# EAGLE design GamePup_Cape (EAGLE 7.7.0)
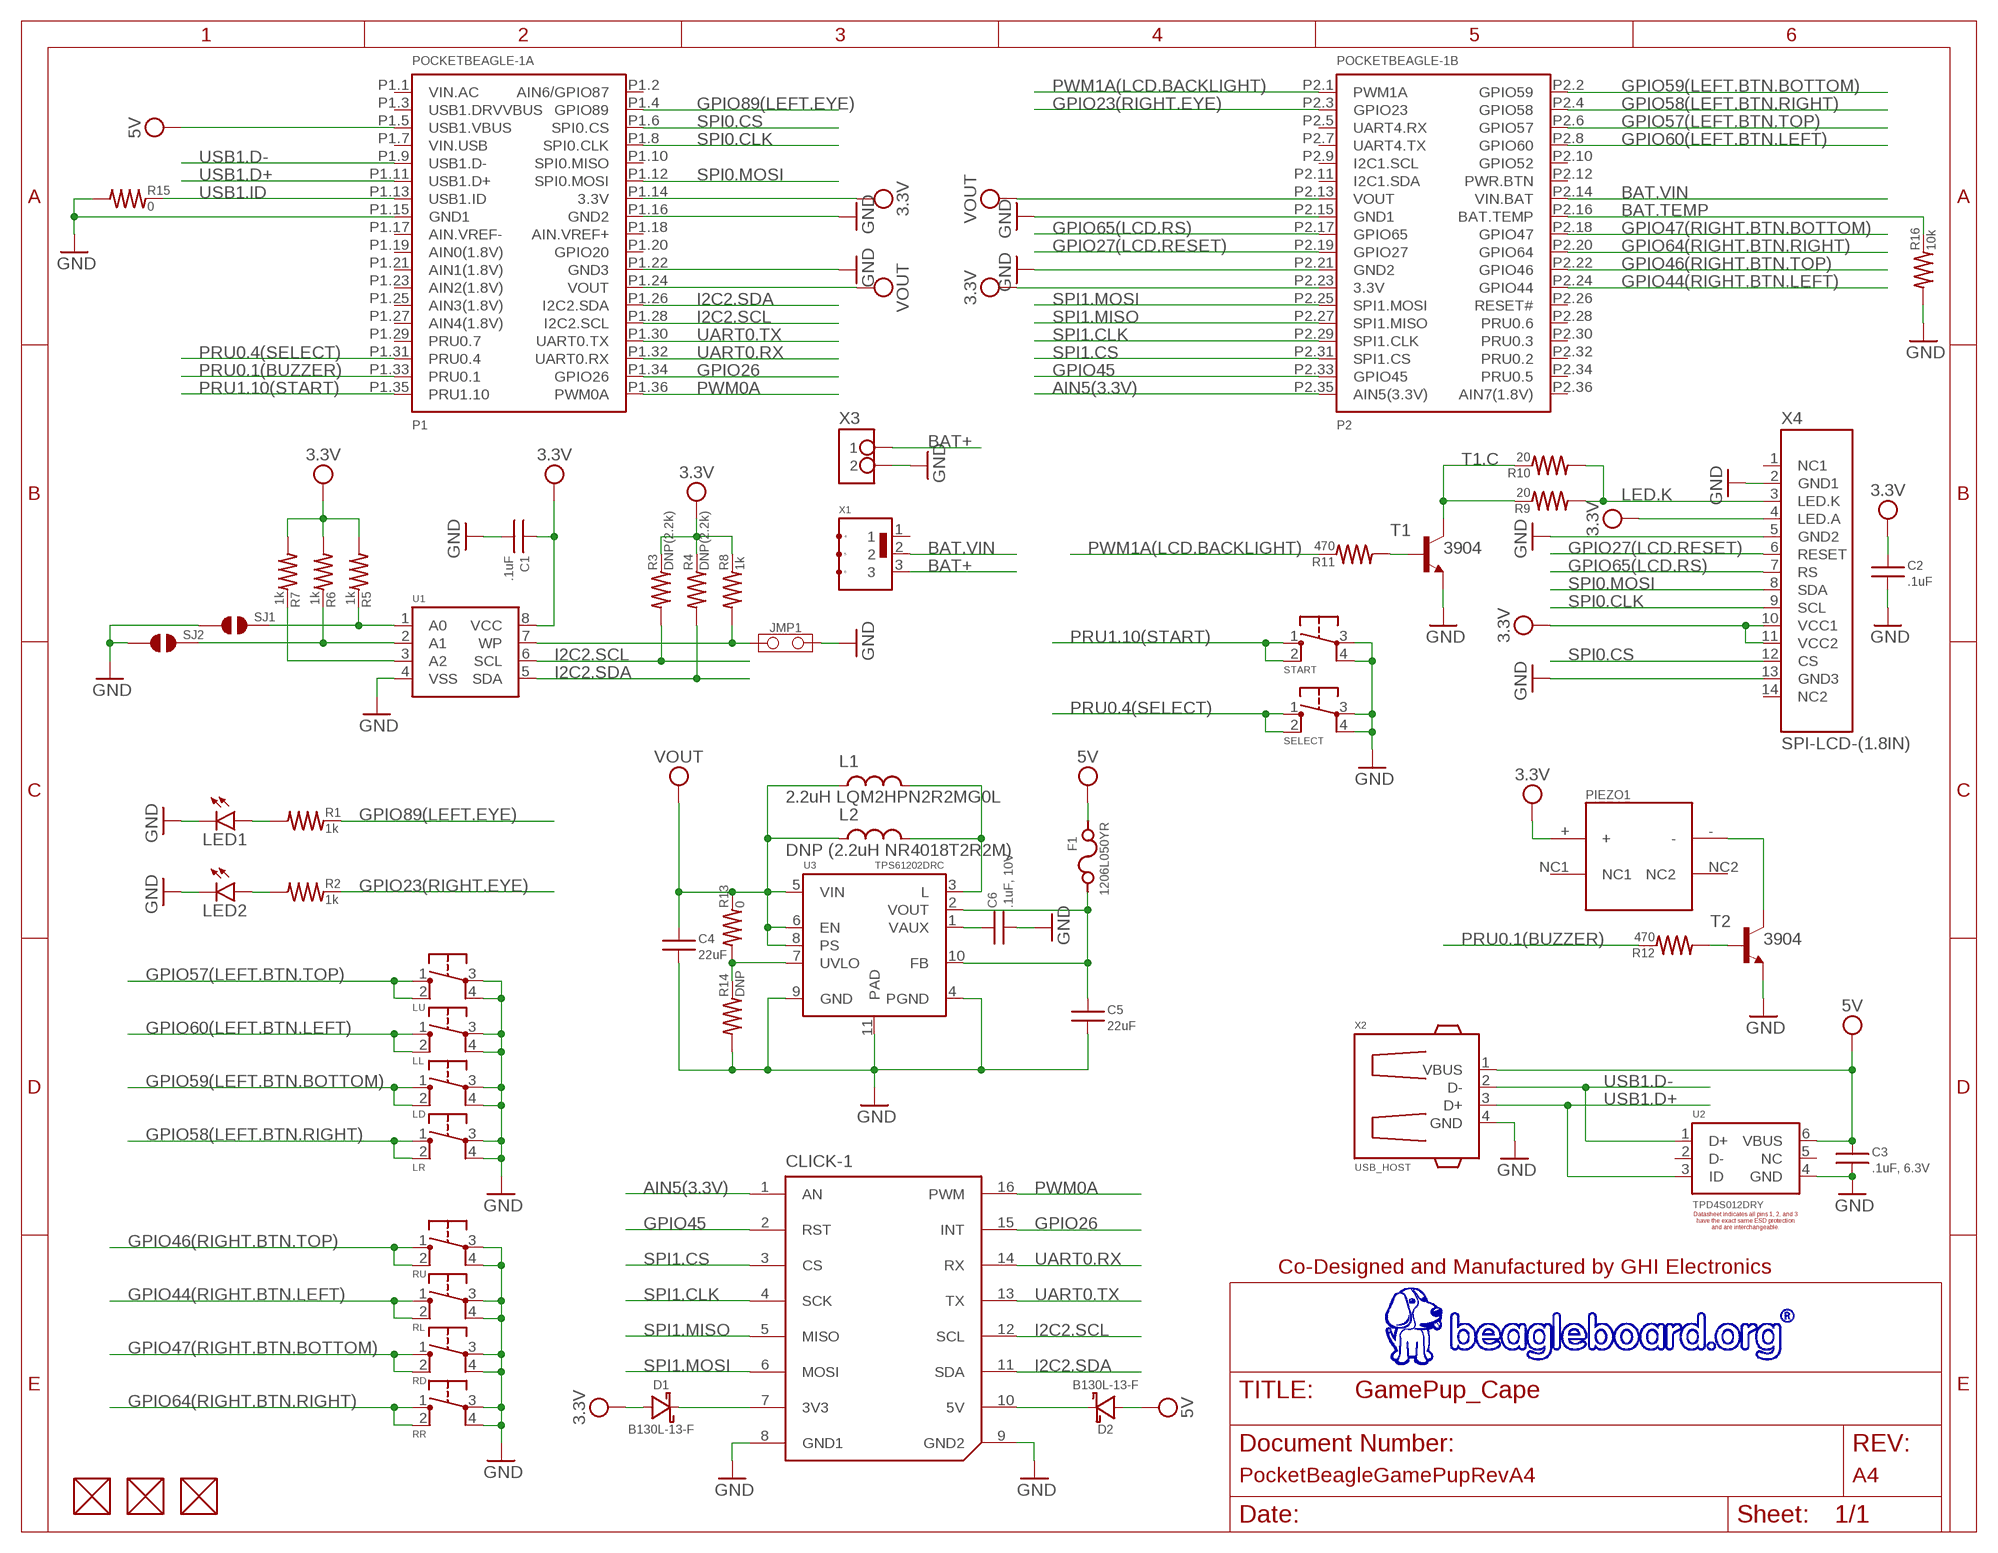
[diagram p0: schematic, sheet 1]

## Parts
C1  .1uF  CAPACITOR-(INCH)-0402  [0402]
C2  .1uF  CAPACITOR-(INCH)-0402  [0402]
C3  .1uF, 6.3V  CAPACITOR-(INCH)-0402  [0402]
C4  22uF  CAPACITOR-(INCH)-0805  [0805]
C5  22uF  CAPACITOR-(INCH)-0805  [0805]
C6  .1uF, 10V  CAPACITOR-(INCH)-0402  [0402]
CLICK-1  PARALLEL-8PIN-0.9INCH_PITCH-SMT_GP  [PARALLEL-8PIN-0.9INCH_PITCH-SMT_GP]
D1  B130L-13-F  DIODE-SCHOTTKY-(DIODES)-SMA  [SMA(DIODES)]
D2  B130L-13-F  DIODE-SCHOTTKY-(DIODES)-SMA  [SMA(DIODES)]
F1  1206L050YR  FUSE-(INCH)-1206  [1206]
FUD1  FIDUCIAL  [FIDUCIAL_40MIL]
FUD2  FIDUCIAL  [FIDUCIAL_40MIL]
FUD3  FIDUCIAL  [FIDUCIAL_40MIL]
JMP1  JUMPER-(X2)  [JUMPER-(X2)]
L1  2.2uH LQM2HPN2R2MG0L  INDUCTOR-(INCH)-1008  [1008]
L2  DNP (2.2uH NR4018T2R2M)  INDUCTOR-(TAIYO-YUDEN)-NRS40  [NR40(TAIYO.YUDEN)]
LD  6MM_TACTILE_SWITCH  [6MM_TACTILE-SWITCH]
LED1  LED-(INCH)-0805  [0805-LED]
LED2  LED-(INCH)-0805  [0805-LED]
LL  6MM_TACTILE_SWITCH  [6MM_TACTILE-SWITCH]
LR  6MM_TACTILE_SWITCH  [6MM_TACTILE-SWITCH]
LU  6MM_TACTILE_SWITCH  [6MM_TACTILE-SWITCH]
PIEZO1  11_X_14_MM_SQUARE_PIEZO  [4_PIN_SQUARE_PIEZO]
POCKETBEAGLE-1  POCKETBEAGLE-(ORIGIN-CENTER)-SMT.PADS(ONLY)-NO.RESTRICT  [POCKETBEAGLE-(ORIGIN-CENTER)-SMT.PADS(ONLY)-NO.RESTRICT]
R1  1k  RESISTOR-(INCH)-0402  [0402]
R2  1k  RESISTOR-(INCH)-0402  [0402]
R3  DNP(2.2k)  RESISTOR-(INCH)-0402  [0402]
R4  DNP(2.2k)  RESISTOR-(INCH)-0402  [0402]
R5  1k  RESISTOR-(INCH)-0402  [0402]
R6  1k  RESISTOR-(INCH)-0402  [0402]
R7  1k  RESISTOR-(INCH)-0402  [0402]
R8  1k  RESISTOR-(INCH)-0402  [0402]
R9  20  RESISTOR-(INCH)-0603  [0603]
R10  20  RESISTOR-(INCH)-0603  [0603]
R11  470  RESISTOR-(INCH)-0603  [0603]
R12  470  RESISTOR-(INCH)-0603  [0603]
R13  0  RESISTOR-(INCH)-0402  [0402]
R14  DNP  RESISTOR-(INCH)-0402  [0402]
R15  0  RESISTOR-(INCH)-0402  [0402]
R16  10k  RESISTOR-(INCH)-0402  [0402]
RD  6MM_TACTILE_SWITCH  [6MM_TACTILE-SWITCH]
RL  6MM_TACTILE_SWITCH  [6MM_TACTILE-SWITCH]
RR  6MM_TACTILE_SWITCH  [6MM_TACTILE-SWITCH]
RU  6MM_TACTILE_SWITCH  [6MM_TACTILE-SWITCH]
SELECT  6MM_TACTILE_SWITCH  [6MM_TACTILE-SWITCH]
SJ1  SOLDER.JOINT-(INCH)-0402  [SOLDER.JOINT(0402)]
SJ2  SOLDER.JOINT-(INCH)-0402  [SOLDER.JOINT(0402)]
START  6MM_TACTILE_SWITCH  [6MM_TACTILE-SWITCH]
T1  3904  BC847-NPN-SOT23-BEC  [SOT23-BEC]
T2  3904  BC847-NPN-SOT23-BEC  [SOT23-BEC]
U1  CAT24C32  [UDFN8,2X3(ON-SEMI)]
U2  TPD4S012DRY  TPD4S012DRYR  [SON-6(TI)-DRY]
U3  TPS61202DRC  TPS6120X  [DRC0010J]
X1  JS102011JAQN  [JS102011JAQN]
X2  USB_HOST  [USB_HOST_HORIZONTAL]
X3  S2B-PH-SM4-TB  [S2B-PH-SM4-TB]
X4  SPI-LCD-(1.8IN)  [LCD-(1.8IN)]

## Nets
3.3V: C1.1 C2.1 D1.A(ANODE) PIEZO1.+ POCKETBEAGLE-1.P1.14(A:3.3V) POCKETBEAGLE-1.P2.23(B:3.3V) R3.2 R4.2 R5.1 R6.1 R7.1 R8.2 U1.8(VCC) X4.4(LED.A) X4.10(VCC1) X4.11(VCC2)
3.3V-PROTECTED: CLICK-1.7(3V3) D1.K(CATHODE)
5V: C3.1 D2.A(ANODE) F1.2 POCKETBEAGLE-1.P1.5(A:USB1.VBUS) U2.6(VBUS) X2.1(VBUS)
5V-PROTECTED: CLICK-1.10(5V) D2.K(CATHODE)
A0: R5.2 SJ1.2 U1.1(A0)
A1: R6.2 SJ2.2 U1.2(A1)
A2: R7.2 U1.3(A2)
AIN5(3.3V): CLICK-1.1(AN) POCKETBEAGLE-1.P2.35(B:AIN5(3.3V))
BAT+: X1.3 X3.1
BAT.TEMP: POCKETBEAGLE-1.P2.16(B:BAT.TEMP) R16.2
BAT.VIN: POCKETBEAGLE-1.P2.14(B:VIN.BAT) X1.2
BOOST.5VOUT: C5.1 F1.1 U3.2(VOUT) U3.10(FB)
GND: C1.2 C2.2 C3.2 C4.2 C5.2 C6.2 CLICK-1.8(GND1) CLICK-1.9(GND2) JMP1.2 LD.3 LD.4 LED1.K LED2.K LL.3 LL.4 LR.3 LR.4 LU.3 LU.4 POCKETBEAGLE-1.P1.15(A:GND1) POCKETBEAGLE-1.P1.16(A:GND2) POCKETBEAGLE-1.P1.22(A:GND3) POCKETBEAGLE-1.P2.15(B:GND1) POCKETBEAGLE-1.P2.21(B:GND2) R14.1 R15.1 R16.1 RD.3 RD.4 RL.3 RL.4 RR.3 RR.4 RU.3 RU.4 SELECT.3 SELECT.4 SJ1.1 SJ2.1 START.3 START.4 T1.E T2.E U1.4(VSS) U2.4(GND) U3.4(PGND) U3.9(GND) U3.11(PAD) X2.4(GND) X3.2 X4.2(GND1) X4.5(GND2) X4.13(GND3)
GPIO23(RIGHT.EYE): POCKETBEAGLE-1.P2.3(B:GPIO23) R2.2
GPIO26: CLICK-1.15(INT) POCKETBEAGLE-1.P1.34(A:GPIO26)
GPIO27(LCD.RESET): POCKETBEAGLE-1.P2.19(B:GPIO27) X4.6(RESET)
GPIO44(RIGHT.BTN.LEFT): POCKETBEAGLE-1.P2.24(B:GPIO44) RL.1 RL.2
GPIO45: CLICK-1.2(RST) POCKETBEAGLE-1.P2.33(B:GPIO45)
GPIO46(RIGHT.BTN.TOP): POCKETBEAGLE-1.P2.22(B:GPIO46) RU.1 RU.2
GPIO47(RIGHT.BTN.BOTTOM): POCKETBEAGLE-1.P2.18(B:GPIO47) RD.1 RD.2
GPIO57(LEFT.BTN.TOP): LU.1 LU.2 POCKETBEAGLE-1.P2.6(B:GPIO57)
GPIO58(LEFT.BTN.RIGHT): LR.1 LR.2 POCKETBEAGLE-1.P2.4(B:GPIO58)
GPIO59(LEFT.BTN.BOTTOM): LD.1 LD.2 POCKETBEAGLE-1.P2.2(B:GPIO59)
GPIO60(LEFT.BTN.LEFT): LL.1 LL.2 POCKETBEAGLE-1.P2.8(B:GPIO60)
GPIO64(RIGHT.BTN.RIGHT): POCKETBEAGLE-1.P2.20(B:GPIO64) RR.1 RR.2
GPIO65(LCD.RS): POCKETBEAGLE-1.P2.17(B:GPIO65) X4.7(RS)
GPIO89(LEFT.EYE): POCKETBEAGLE-1.P1.4(A:GPIO89) R1.2
I2C2.SCL: CLICK-1.12(SCL) POCKETBEAGLE-1.P1.28(A:I2C2.SCL) R3.1 U1.6(SCL)
I2C2.SDA: CLICK-1.11(SDA) POCKETBEAGLE-1.P1.26(A:I2C2.SDA) R4.1 U1.5(SDA)
L: L1.2 L2.2 U3.3(L)
LED.K: R9.1 R10.1 X4.3(LED.K)
N$1: LED2.A R2.1
N$2: LED1.A R1.1
N$5: R11.1 T1.B
N$36: PIEZO1.- T2.C
N$37: R12.1 T2.B
N$40: R13.1 R14.2 U3.7(UVLO)
PRU0.1(BUZZER): POCKETBEAGLE-1.P1.33(A:PRU0.1) R12.2
PRU0.4(SELECT): POCKETBEAGLE-1.P1.31(A:PRU0.4) SELECT.1 SELECT.2
PRU1.10(START): POCKETBEAGLE-1.P1.35(A:PRU1.10) START.1 START.2
PWM0A: CLICK-1.16(PWM) POCKETBEAGLE-1.P1.36(A:PWM0A)
PWM1A(LCD.BACKLIGHT): POCKETBEAGLE-1.P2.1(B:PWM1A) R11.2
SPI0.CLK: POCKETBEAGLE-1.P1.8(A:SPI0.CLK) X4.9(SCL)
SPI0.CS: POCKETBEAGLE-1.P1.6(A:SPI0.CS) X4.12(CS)
SPI0.MOSI: POCKETBEAGLE-1.P1.12(A:SPI0.MOSI) X4.8(SDA)
SPI1.CLK: CLICK-1.4(SCK) POCKETBEAGLE-1.P2.29(B:SPI1.CLK)
SPI1.CS: CLICK-1.3(CS) POCKETBEAGLE-1.P2.31(B:SPI1.CS)
SPI1.MISO: CLICK-1.5(MISO) POCKETBEAGLE-1.P2.27(B:SPI1.MISO)
SPI1.MOSI: CLICK-1.6(MOSI) POCKETBEAGLE-1.P2.25(B:SPI1.MOSI)
T1.C: R9.2 R10.2 T1.C
UART0.RX: CLICK-1.14(RX) POCKETBEAGLE-1.P1.32(A:UART0.RX)
UART0.TX: CLICK-1.13(TX) POCKETBEAGLE-1.P1.30(A:UART0.TX)
USB1.D+: POCKETBEAGLE-1.P1.11(A:USB1.D+) U2.3(ID) X2.3(D+)
USB1.D-: POCKETBEAGLE-1.P1.9(A:USB1.D-) U2.1(D+) X2.2(D-)
USB1.ID: POCKETBEAGLE-1.P1.13(A:USB1.ID) R15.2
VAUX: C6.1 U3.1(VAUX)
VOUT: C4.1 L1.1 L2.1 POCKETBEAGLE-1.P1.24(A:VOUT) POCKETBEAGLE-1.P2.13(B:VOUT) R13.2 U3.5(VIN) U3.6(EN) U3.8(PS)
WP: JMP1.1 R8.1 U1.7(WP)
Unconnected: FUD1.P$1 FUD2.P$1 FUD3.P$1 PIEZO1.NC1 PIEZO1.NC2 POCKETBEAGLE-1.P1.1(A:VIN.AC) POCKETBEAGLE-1.P1.2(A:AIN6/GPIO87) POCKETBEAGLE-1.P1.3(A:USB1.DRVVBUS) POCKETBEAGLE-1.P1.7(A:VIN.USB) POCKETBEAGLE-1.P1.10(A:SPI0.MISO) POCKETBEAGLE-1.P1.17(A:AIN.VREF-) POCKETBEAGLE-1.P1.18(A:AIN.VREF+) POCKETBEAGLE-1.P1.19(A:AIN0(1.8V)) POCKETBEAGLE-1.P1.20(A:GPIO20) POCKETBEAGLE-1.P1.21(A:AIN1(1.8V)) POCKETBEAGLE-1.P1.23(A:AIN2(1.8V)) POCKETBEAGLE-1.P1.25(A:AIN3(1.8V)) POCKETBEAGLE-1.P1.27(A:AIN4(1.8V)) POCKETBEAGLE-1.P1.29(A:PRU0.7) POCKETBEAGLE-1.P2.5(B:UART4.RX) POCKETBEAGLE-1.P2.7(B:UART4.TX) POCKETBEAGLE-1.P2.9(B:I2C1.SCL) POCKETBEAGLE-1.P2.10(B:GPIO52) POCKETBEAGLE-1.P2.11(B:I2C1.SDA) POCKETBEAGLE-1.P2.12(B:PWR.BTN) POCKETBEAGLE-1.P2.26(B:RESET#) POCKETBEAGLE-1.P2.28(B:PRU0.6) POCKETBEAGLE-1.P2.30(B:PRU0.3) POCKETBEAGLE-1.P2.32(B:PRU0.2) POCKETBEAGLE-1.P2.34(B:PRU0.5) POCKETBEAGLE-1.P2.36(B:AIN7(1.8V)) U2.2(D-) U2.5(NC) X1.1 X1.4 X1.5 X1.6 X4.1(NC1) X4.14(NC2)

## Notes on the sheet
- Datasheet indicates all pins 1, 2, and 3
  have the exact same ESD protection
  and are interchangeable.
- Co-Designed and Manufactured by GHI Electronics
- PocketBeagleGamePupRevA4 | A4

## Library data of the parts
C1-C6 = GHI-BasicComponents:CAPACITOR-(INCH)-: Basic SMD ceramic capacitors
CLICK-1 = GHI-Headers:PARALLEL-8PIN-0.9INCH_PITCH-SMT: Dual Parallel 8pin surface mount headers spaced by 0.9 inch pitch.
D1 D2 = GHI-BasicComponents:DIODE-SCHOTTKY-(DIODES)-
F1 = GHI-BasicComponents:FUSE-(INCH)-
FUD1-FUD3 = GHI:FIDUCIAL
JMP1 = GHI-Headers:JUMPER-(X2)
L1 = GHI-BasicComponents:INDUCTOR-(INCH)-
L2 = GHI-BasicComponents:INDUCTOR-(TAIYO-YUDEN)-NRS
LD LL LR LU RD RL RR RU SELECT START = GHI2:6MM_TACTILE_SWITCH
LED1 LED2 = GHI-BasicComponents:LED-(INCH)-: Basic SMD LEDs
PIEZO1 = GHI2:11_X_14_MM_SQUARE_PIEZO
POCKETBEAGLE-1 = GHI-Solutions:POCKETBEAGLE
R1-R16 = GHI-BasicComponents:RESISTOR-(INCH)-: Basic SMD Resistors
SJ1 SJ2 = GHI-Miscellaneous:SOLDER.JOINT-(INCH)-: Solder Joint (Bridge) Pads - For easy solder joining.
T1 T2 = transistor:*-NPN-: NPN Transistror BF959 corrected 2008.03.06
U1 = GHI-IC:CAT24C32: 32-Kb I2C CMOS Serial EEPROM
U2 = GHI-IC:TPD4S012DRYR: TPD4S012 4-Channel ESD Solution for USB-HS/USB OTG/USB Charger Interface
U3 = GHI-IC:TPS6120X: TPS6120x Low Input Voltage Synchronous Boost Converter With 1.3-A Switches; VALUE: TPS6120x
X1 = GHI-InputDevices:JS102011JAQN
X2 = GHI2:USB_HOST
X3 = GHI-Connectors:S2B-PH-SM4-TB: JST PH Connector 2 Pin 2mm Pitch
X4 = GHI-Connectors:SPI-LCD-(1.8IN)

## Board
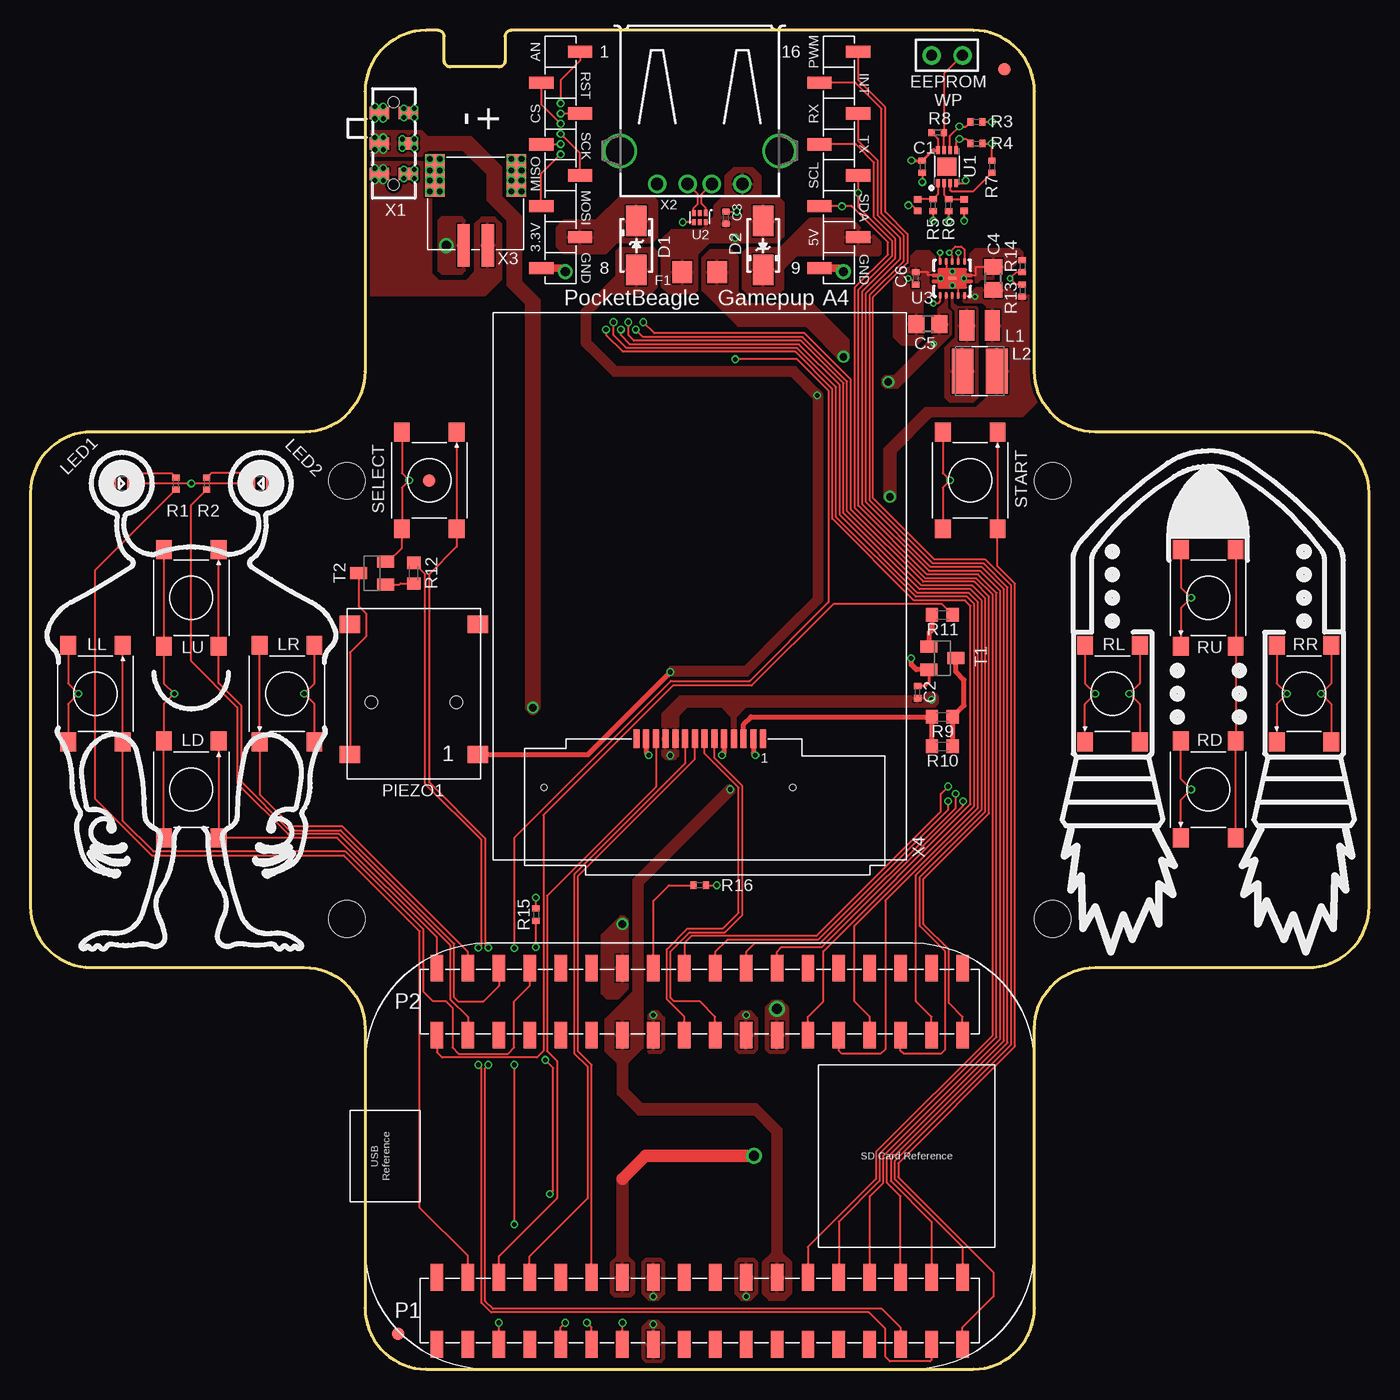
[diagram p1: board, top side]
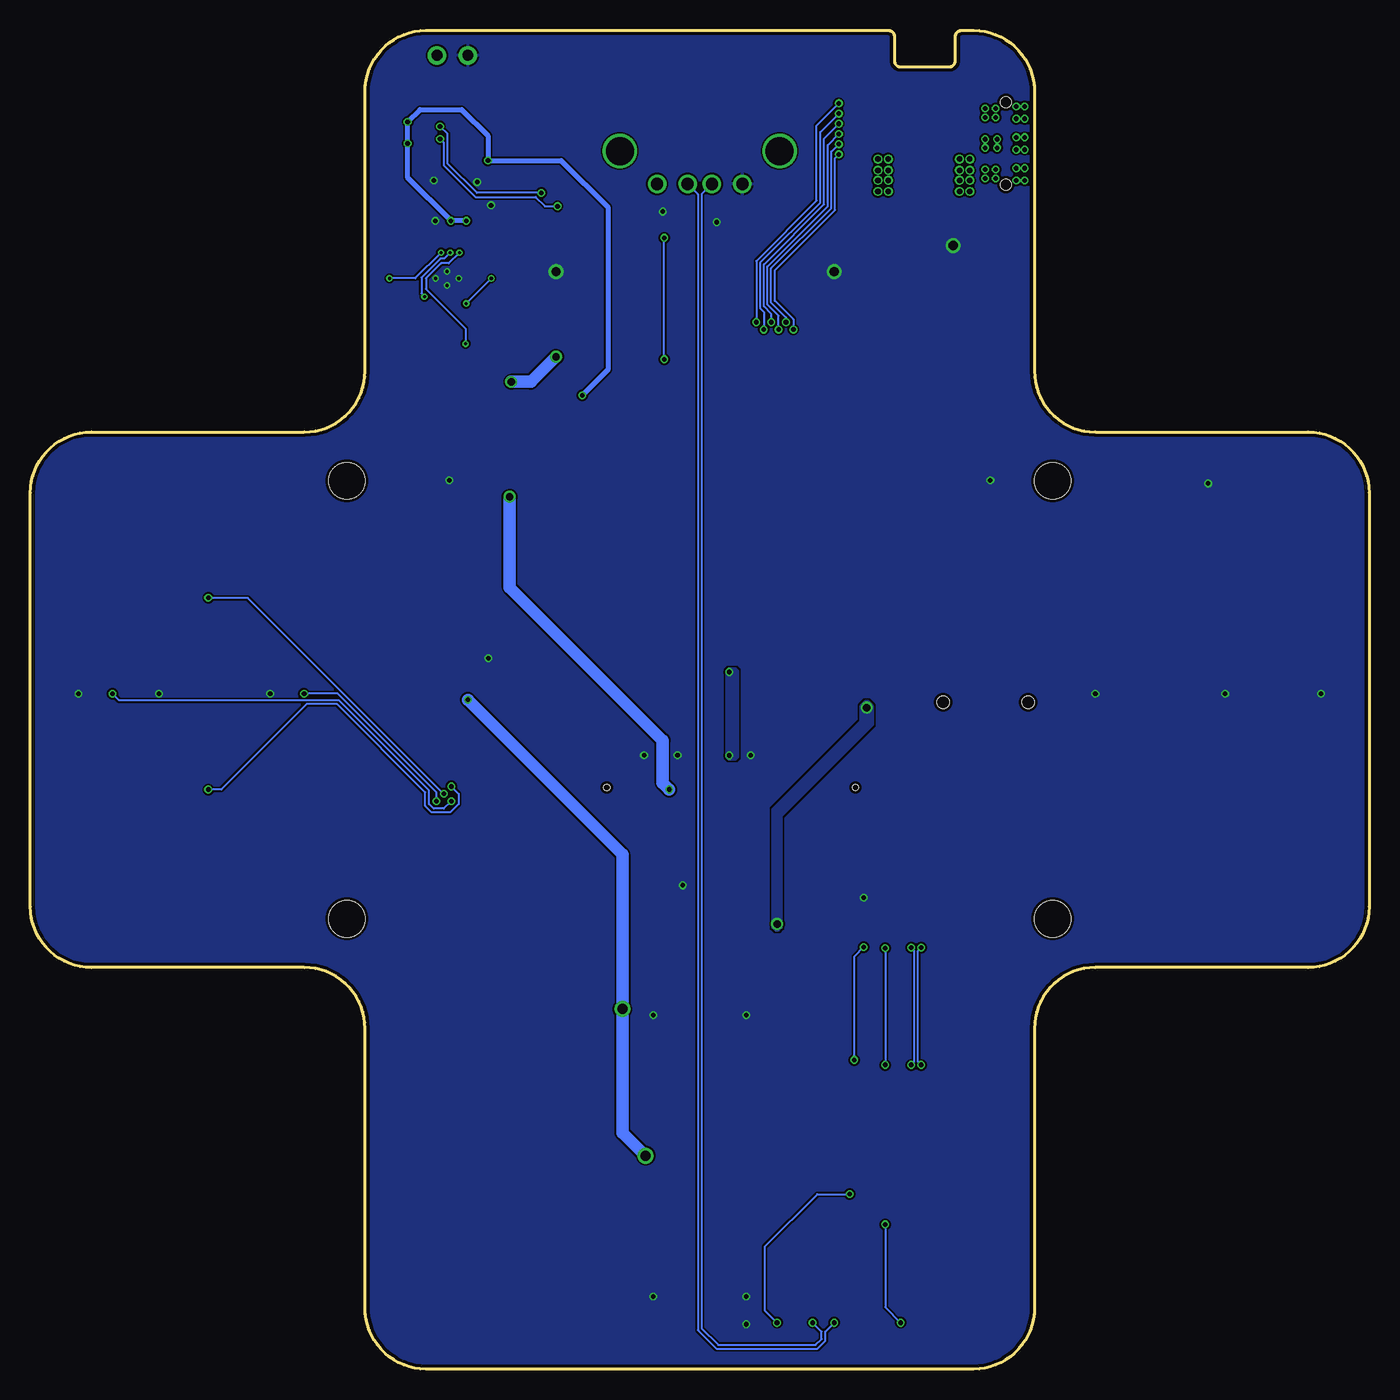
[diagram p2: board, bottom side, seen from below]

Size 110 x 110 mm. Coordinates in mm from the lower left corner, seen from the top.
Outline: 27.5,28 27.5,5 arc90 32.5,0 77.5,0 arc90 82.5,5 82.5,28 arc-90 87.5,33 105,33 arc90 110,38 110,72 arc90 105,77 87.5,77 arc-90 82.5,82 82.5,105 arc90 77.5,110 39.5,110 arc90 39,109.5 39,107.5 arc-90 38.5,107 34.5,107 arc-90 34,107.5 34,109.5 arc90 33.5,110 32.5,110 arc90 27.5,105 27.5,82 arc-90 22.5,77 5,77 arc90 0,72 0,38 arc90 5,33 22.5,33 arc-90 27.5,28
Copper layers (1+16): Top 0.035mm / dielectric 1.5mm / Bottom 0.035mm
Design rules "default *": minimum track width 6mil, minimum drill 10mil, track to track 6mil, track to pad 6mil, pad to pad 6mil, via to via 6mil, smd to smd 6mil, copper to edge 10mil, drill to drill 8mil, minimum pad ring 10mil, minimum via ring 5mil, stop-mask expansion 4mil, vias tented up to drill 40mil, thermal gap 6mil
Holes 3 mm at 26,73 26,37 84,73 84,37
tRestrict: area 52.5,51.6 to 52.7,52.1
Milling: 32 lines

### Footprints (pad centres in the part's own frame; a part is rotated, then mirrored left to right if it is on the bottom)
0402 = smd 0.5 x 0.6: 1 -0.5,0; 2 0.5,0
0805 = smd 1.3 x 1.5: 1 -0.95,0; 2 0.95,0
PARALLEL-8PIN-0.9INCH_PITCH-SMT_GP = smd 2 x 1: 1 -9.84,8.89; 2 -13.02,6.35; 3 -9.84,3.81; 4 -13.02,1.27; 5 -9.84,-1.27; 6 -13.02,-3.81; 7 -9.84,-6.35; 8 -13.02,-8.89; 9 9.84,-8.89; 10 13.02,-6.35; 11 9.84,-3.81; 12 13.02,-1.27; 13 9.84,1.27; 14 13.02,3.81; 15 9.84,6.35; 16 13.02,8.89
SMA(DIODES) = smd 2.5 x 1.7: A 2,0; K -2,0
1206 = smd 1.6 x 1.803: 1 -1.422,0; 2 1.422,0
FIDUCIAL_40MIL = smd 1.016 x 1.016: P$1 0,0
JUMPER-(X2) = drill 0.889 pad 1.524: 1 -1.27,0; 2 1.27,0
1008 = smd 1.25 x 2.5: 1 -1.05,0; 2 1.05,0
NR40(TAIYO.YUDEN) = smd 1.8 x 3.7: 1 -1.4,0; 2 1.4,0
6MM_TACTILE-SWITCH = smd 1.55 x 1.3: 1 -3.975,2.25; 2 3.975,2.25; 3 -3.975,-2.25; 4 3.975,-2.25
0805-LED = smd 1.2 x 1.2: A 0,1.05; K 0,-1.05
4_PIN_SQUARE_PIEZO = smd 1.7 x 1.4: + -5.25,4.3; - 5.25,4.3; NC1 -5.25,-6.4; NC2 5.25,-6.4 | hole 1: -3.5,0; 3.5,0
POCKETBEAGLE-(ORIGIN-CENTER)-SMT.PADS(ONLY)-NO.RESTRICT = smd 1.02 x 2.2: P1.1 -21.59,-15.45; P1.2 -21.59,-9.95; P1.3 -19.05,-15.45; P1.4 -19.05,-9.95; P1.5 -16.51,-15.45; P1.6 -16.51,-9.95; P1.7 -13.97,-15.45; P1.8 -13.97,-9.95; P1.9 -11.43,-15.45; P1.10 -11.43,-9.95; P1.11 -8.89,-15.45; P1.12 -8.89,-9.95; P1.13 -6.35,-15.45; P1.14 -6.35,-9.95; P1.15 -3.81,-15.45; P1.16 -3.81,-9.95; P1.17 -1.27,-15.45; P1.18 -1.27,-9.95; P1.19 1.27,-15.45; P1.20 1.27,-9.95; P1.21 3.81,-15.45; P1.22 3.81,-9.95; P1.23 6.35,-15.45; P1.24 6.35,-9.95; P1.25 8.89,-15.45; P1.26 8.89,-9.95; P1.27 11.43,-15.45; P1.28 11.43,-9.95; P1.29 13.97,-15.45; P1.30 13.97,-9.95; P1.31 16.51,-15.45; P1.32 16.51,-9.95; P1.33 19.05,-15.45; P1.34 19.05,-9.95; P1.35 21.59,-15.45; P1.36 21.59,-9.95; P2.1 -21.59,9.95; P2.2 -21.59,15.45; P2.3 -19.05,9.95; P2.4 -19.05,15.45; P2.5 -16.51,9.95; P2.6 -16.51,15.45; P2.7 -13.97,9.95; P2.8 -13.97,15.45; P2.9 -11.43,9.95; P2.10 -11.43,15.45; P2.11 -8.89,9.95; P2.12 -8.89,15.45; P2.13 -6.35,9.95; P2.14 -6.35,15.45; P2.15 -3.81,9.95; P2.16 -3.81,15.45; P2.17 -1.27,9.95; P2.18 -1.27,15.45; P2.19 1.27,9.95; P2.20 1.27,15.45; P2.21 3.81,9.95; P2.22 3.81,15.45; P2.23 6.35,9.95; P2.24 6.35,15.45; P2.25 8.89,9.95; P2.26 8.89,15.45; P2.27 11.43,9.95; P2.28 11.43,15.45; P2.29 13.97,9.95; P2.30 13.97,15.45; P2.31 16.51,9.95; P2.32 16.51,15.45; P2.33 19.05,9.95; P2.34 19.05,15.45; P2.35 21.59,9.95; P2.36 21.59,15.45
0603 = smd 1 x 1.1: 1 -0.85,0; 2 0.85,0
SOLDER.JOINT(0402) = smd 0.55 x 0.6: 1 -0.475,0; 2 0.475,0
SOT23-BEC = smd 1 x 1.4: B -0.95,-1.1; C 0,1.1; E 0.95,-1.1
UDFN8,2X3(ON-SEMI) = smd 0.3 x 0.68: 1 0.75,1.36; 2 0.25,1.36; 3 -0.25,1.36; 4 -0.75,1.36; 5 -0.75,-1.36; 6 -0.25,-1.36; 7 0.25,-1.36; 8 0.75,-1.36 | smd 1.56 x 1.45: P$1 0,0
SON-6(TI)-DRY = smd 0.3 x 0.52: 1 -0.5,-0.38 | smd 0.3 x 0.49: 2 0,-0.375; 3 0.5,-0.375; 4 0.5,0.375; 5 0,0.375; 6 -0.5,0.375
DRC0010J = smd 0.6 x 0.24: 1 -1.4,1; 2 -1.4,0.5; 3 -1.4,0; 4 -1.4,-0.5; 5 -1.4,-1; 6 1.4,-1; 7 1.4,-0.5; 8 1.4,0; 9 1.4,0.5; 10 1.4,1 | smd 0.24 x 0.6: 11 0,0
JS102011JAQN = smd 1 x 1.6: 1 -2.5,-1.2; 2 0,-1.2; 3 2.5,-1.2; 4 -2.5,1.2; 5 0,1.2; 6 2.5,1.2 | hole 0.9: -3.4,0; 3.4,0
USB_HOST_HORIZONTAL = drill 1: 1 3.5,-12.99; 2 1,-12.99; 3 -1,-12.99; 4 -3.5,-12.99 | drill 2.3: CG1 6.57,-10.28; CG2 -6.57,-10.28
S2B-PH-SM4-TB = smd 1 x 3.5: 1 1,-2.85; 2 -1,-2.85 | smd 1.6 x 3.5: A1 3.35,2.9; A2 -3.35,2.9
LCD-(1.8IN) = smd 0.5 x 1.5: 1 5.2,-12.532; 2 4.4,-12.532; 3 3.6,-12.532; 4 2.8,-12.532; 5 2,-12.532; 6 1.2,-12.532; 7 0.4,-12.532; 8 -0.4,-12.532; 9 -1.2,-12.532; 10 -2,-12.532; 11 -2.8,-12.532; 12 -3.6,-12.532; 13 -4.4,-12.532; 14 -5.2,-12.532 | hole 0.5: -12.8,-16.532; 7.65,-16.532

### Placement (x,y rotation side)
C1  73.29,98.81 270 top
C2  72.91,55.63 90 top
C3  57.16,94.61 90 top
C4  79.12,89.62 90 top
C5  73.75,85.88 180 top
C6  72.75,89.62 90 top
CLICK-1  55,99.36 0 top
D1  49.79,92.33 270 top
D2  60.21,92.33 90 top
F1  55,90.14 180 top
FUD1  30.22,2.9 0 top
FUD2  80.02,106.81 180 top
FUD3  32.77,73.03 0 top
JMP1  75.32,107.95 180 top
L1  78,85.75 180 top
L2  78,82 180 top
LD  13.22,47.62 270 top
LED1  7.5,72.77 90 top
LED2  18.93,72.77 270 top
LL  5.34,55.5 270 top
LR  21.09,55.5 90 top
LU  13.22,63.37 270 top
PIEZO1  31.5,54.8 180 top
POCKETBEAGLE-1  55,17.5 0 top
R1  11.95,72.77 270 top
R2  14.49,72.77 270 top
R3  77.73,102.49 0 top
R4  77.73,100.71 0 top
R5  74.18,95.63 90 top
R6  75.45,95.63 90 top
R7  79,98.81 270 top
R8  74.56,101.6 180 top
R9  74.94,53.59 0 top
R10  74.94,51.18 0 top
R11  74.94,61.98 0 top
R12  31.5,65.41 90 top
R13  81.5,88.62 270 top
R14  81.5,90.62 270 top
R15  41.54,37.34 270 top
R16  55,39.75 180 top
RD  96.78,47.62 90 top
RL  88.91,55.5 90 top
RR  104.66,55.5 90 top
RU  96.78,63.37 90 top
SELECT  32.77,73.03 270 top
SJ1  72.91,95.63 90 top
SJ2  76.72,95.63 90 top
START  77.22,73.03 270 top
T1  74.94,58.42 270 top
T2  28.08,65.41 90 top
U1  75.32,98.81 180 top
U2  55,94.61 180 top
U3  75.75,89.62 90 top
X1  29.85,100.71 270 top
X2  55,110.38 0 top
X3  36.59,95.2 0 top
X4  55,64.33 0 top

### Tracks (layer width: path | path; a pad name or v marks a point on that pad's centre or on a via)
3.3V  (via drill 0.38 pad 0.18, 0.81, 0.81 pad 0.18)
  Top 0.152: R8.2 74.57,101.09 U1.8 | R5.1 v74.18,94.36 | R6.1 v75.45,94.36 | R4.2 v79,100.71 R7.1 | R3.2 v79,102.49
  Top 0.254: v72.4,99.31 v72.41,99.31 C1.1 74.15,100.17 U1.8
  Top 0.406: PIEZO1.+ 45.81,50.5 v52.59,57.28
  Top 1.016: v59.45,17.53 50.55,17.53 48.65,15.62
  Bottom 0.406: v74.18,94.36 v75.45,94.36 79,97.92 v79,100.71 v79,102.49 77.99,103.5 74.56,103.5 72.4,101.35 v72.4,99.31 66.38,99.31 62.54,95.48 62.54,82.12 v64.65,80.01
  Bottom 1.016: v74.05,54.99 61.35,42.29 v61.35,29.59 61.35,19.43 v59.45,17.53
  other vias: 52.59,50.42
  pour Top: 53.22,50.42 53.22,53.72 53.98,54.48 56.78,54.48 57.67,53.59 57.67,51.56 57.92,51.56 57.92,53.59 58.81,54.48 74.3,54.48 74.56,54.74 74.56,55.24 74.3,55.5 73.8,55.5 73.54,55.24 53.35,55.24 51.95,53.85 51.95,50.42 52.21,50.16 52.97,50.16
  pour Top: 60.72,26.04 61.98,26.04 62.24,26.29 62.24,29.72 61.73,30.23 60.97,30.23 60.46,29.72 60.46,26.29
  pour Bottom: 52.79,57.38 52.79,50.29 52.64,50.14 52.03,50.14 51.88,50.29 51.88,57.38 52.03,57.53 52.64,57.53
  pour Top: 52.33,57.02 58.94,57.02 64.53,62.61 65.03,63.12 65.03,67.31 65.03,80.14 64.4,80.77 62.87,82.3 57.67,82.3 48.14,82.3 45.98,84.45 45.98,86.74 47.63,88.39 50.94,88.39 51.44,88.9 51.44,91.82 51.19,92.08 48.4,92.08 48.14,91.82 48.14,89.79 45.6,87.25 45.35,87 45.35,85.72 45.35,84.2 46.36,83.19 47.89,81.66 49.28,81.66 62.49,81.66 64.4,79.76 64.4,63.37 61.86,60.83 58.68,57.66 52.59,57.66 52.33,57.4
  pour Top: 48.65,15.88 49.03,15.49 49.03,15.11 49.03,9.27 49.54,8.76 49.54,6.22 49.28,5.97 48.02,5.97 47.76,6.22 47.76,8.76 48.27,9.27 48.27,15.49
3.3V-PROTECTED
  pour Top: 49.79,92.58 48.14,92.58 47.76,92.2 47.25,91.69 43.82,91.69 43.32,92.2 43.32,93.09 43.32,93.85 43.82,94.36 46.49,94.36 48.52,96.39 51.06,96.39 51.44,96.01 51.44,92.96 51.06,92.58
5V  (via drill 0.38, 0.38 pad 0.18)
  Top 0.152: POCKETBEAGLE-1.P1.5 v38.49,3.81 | v39.76,34.59 39.76,43.66 52.64,56.54 59.12,56.54 65.59,63.02 65.59,80.39 63,82.98 v57.92,82.98 | v39.76,24.99 v39.76,11.89
  Bottom 0.152: v57.92,82.98 v57.92,92.96 | v39.76,34.59 v39.76,24.99 | v39.76,11.89 39.76,5.08 v38.49,3.81
  pour Top: 59.32,98.68 59.95,98.04 59.95,96.52 60.21,96.27 61.48,96.27 61.86,95.89 61.86,93.09 61.35,92.58 55.76,92.58 54.75,91.57 54.75,88.65 54.49,88.39 52.46,88.39 51.95,88.9 51.95,92.84 52.71,93.6 55.13,93.6 55.38,93.85 55.38,94.11 55.63,94.36 55.89,94.36 56.27,94.74 56.27,95.63 57.16,96.52 57.16,98.04 57.79,98.68
5V-PROTECTED
  pour Top: 69.35,93.09 68.84,93.09 67.45,94.49 64.02,94.49 61.6,92.08 58.94,92.08 58.56,91.69 58.56,88.77 58.94,88.39 61.48,88.39 61.86,88.77 61.86,90.42 63,91.57 69.73,91.57 69.86,91.69 69.86,92.58
A0
  Top 0.152: U1.1 74.57,96.52 R5.2 72.93,96.13 SJ1.2
A1
  Top 0.152: U1.2 75.07,96.51 R6.2 76.69,96.13 SJ2.2
A2
  Top 0.152: U1.3 75.57,96.91 75.7,96.77 77.47,96.77 R7.2
AIN5(3.3V)  (via drill 0.38)
  Top 0.152: POCKETBEAGLE-1.P2.35 76.59,28.96 75.47,30.07 75.47,34.47 73.39,36.55 73.39,40.28 78.77,45.67 78.77,63.48 77.56,64.69 73.36,64.69 67.42,70.64 67.42,81.31 63.61,85.11 51.27,85.11 v50.35,86.03 | CLICK-1.1 45.16,107.51 43.57,105.92 v43.57,104.01
  Bottom 0.152: v50.35,86.03 50.35,91.06 45.4,96.01 45.4,102.18 v43.57,104.01
BAT+  (via drill 0.38 pad 0.18)
  other vias: 28.3,98.68 28.3,97.66 28.99,97.66 28.99,98.68
  pour Top (rank 2): 38.62,94.11 38.62,89.53 37.35,88.27 27.19,88.27 27.19,99.19 32.39,99.19 32.9,98.68 32.9,90.04 33.54,89.41 35.82,89.41 36.59,90.17 36.59,94.11 37.09,94.61 38.11,94.61
BAT.TEMP
  Top 0.152: POCKETBEAGLE-1.P2.16 51.19,38.47 52.47,39.75 R16.2
BAT.VIN  (via drill 0.38 pad 0.18, 0.61 pad 0.18)
  other vias: 41.28,54.36 28.3,101.22 28.99,101.22 28.3,100.2 28.99,100.2 48.65,36.58
  pour Bottom: 48.78,36.07 48.52,36.07 48.27,36.32 48.27,45.47 40.78,52.96 40.78,54.48 41.16,54.86 41.41,54.86 41.79,54.48 41.79,53.21 49.03,45.97 49.03,36.32
  pour Top: 41.41,53.85 41.16,53.85 40.78,54.23 40.78,87.5 39.25,89.03 39.25,94.36 37.6,96.01 37.6,98.17 35.57,100.2 32.65,100.2 32.14,99.69 27.19,99.69 27.19,101.73 32.14,101.73 32.65,101.22 36.2,101.22 38.62,98.81 38.62,96.39 40.27,94.74 40.27,89.41 41.79,87.88 41.79,54.23
  pour Top: 48.78,37.21 49.03,36.96 49.03,35.94 49.03,31.24 48.27,30.48 47.38,30.48 47,30.86 47,35.69 48.52,37.21
BOOST.5VOUT  (via drill 0.25, 0.61)
  Top 0.152: U3.10 v74.75,91.75
  Bottom 0.152: v74.75,91.75 75.62,90.88 76.25,90.88 77.5,89.62 77.5,88.75 74.25,85.5 v74.25,84.25
  Bottom 1.016: v66.81,83.19 68.87,81.12 v70.5,81.12
  pour Top: 75.31,88.25 75.31,87.19 75.62,86.88 75.62,85 71.25,80.62 70.25,80.62 70,80.88 70,81.38 70.25,81.62 71,81.62 74.25,84.88 74.25,86 74.62,86.38 74.62,87.12 75.19,87.69 75.19,88.25
  pour Top: 55.89,91.95 57.54,91.95 58.05,91.44 58.05,88.52 59.06,87.5 64.27,87.5 67.19,84.58 67.19,83.06 66.94,82.8 66.68,82.8 63.76,85.72 58.17,85.72 55.25,88.65 55.25,91.31
GND  (via drill 0.25, 0.38, 0.38 pad 0.18, 0.76 pad 0.18)
  Top 0.152: LED2.K v13.22,72.77 LED1.K | LL.3 3.09,56.35 v3.95,55.5 3.09,54.65 LL.4 | LD.4 LD.3 10.97,54.65 v11.82,55.5 10.97,56.35 LU.4 LU.3 | LR.3 23.34,54.65 v22.49,55.5 23.34,56.35 LR.4 | RU.4 RU.3 99.03,55.92 v99.45,55.5 99.03,55.08 RD.4 RD.3 | RR.4 106.91,56.35 v106.05,55.5 106.91,54.65 RR.3 | RL.4 91.16,56.35 v90.31,55.5 91.16,54.65 RL.3 | C1.2 v73.29,97.54 | SJ1.1 72.43,95.63 v72.14,95.63 | U1.4 76.63,97.45 v76.84,97.66 | SJ2.1 v76.72,94.36 | SELECT.3 30.52,73.62 v31.12,73.03 30.52,72.43 SELECT.4 30.52,67.47 29.41,66.36 T2.E | START.3 74.97,73.62 v75.57,73.03 74.97,72.43 START.4 | R15.1 v41.54,38.73 | U3.9 75.25,90.2 v75.75,90.2 | U3.4 76.25,89.05 v75.75,89.05 U3.11 | v76.7,89.62 76.7,89.88 77.69,89.88 77.69,90.58 C4.2 | v74.8,89.62 74.8,89.88 73.75,89.88 73.75,90.12 C6.2 | R16.1 v56.4,39.75 | C3.2 v58.05,95.11 | U2.4 v53.6,94.24
  Top 0.254: T1.E 73.84,56.43 73.53,56.13 C2.2
  Top 0.406: T1.E 72.79,57.47 72.37,57.89 v72.37,58.42 | X4.2 59.4,50.62 v59.57,50.44 | X4.5 57,50.62 v56.83,50.44 | X4.13 50.6,50.65 v50.81,50.44
  Top 0.61: CLICK-1.8 43.65,90.47 v43.95,90.17 | CLICK-1.9 66.51,90.47 v66.81,90.17
  other vias: 34.17,92.32 51.19,3.68 58.81,5.97 51.19,5.97 58.81,29.08 51.19,29.08
  pour Bottom (rank 2): -1,-1 111,-1 111,111 -1,111
  pour Top: 35.7,90.3 35.7,94.36 35.44,94.61 33.79,94.61 33.54,94.36 33.54,90.3 33.79,90.04 35.44,90.04
  pour Top: 50.55,0.64 51.83,0.64 52.08,0.89 52.08,3.43 51.57,3.94 50.81,3.94 50.3,3.43 50.3,0.89
  pour Top: 59.45,9.02 58.17,9.02 57.92,8.76 57.92,6.22 58.43,5.71 59.19,5.71 59.7,6.22 59.7,8.76
  pour Top: 51.83,9.02 50.55,9.02 50.3,8.76 50.3,6.22 50.81,5.71 51.57,5.71 52.08,6.22 52.08,8.76
  pour Top: 58.17,26.04 59.45,26.04 59.7,26.29 59.7,28.83 59.19,29.34 58.43,29.34 57.92,28.83 57.92,26.29
  pour Top: 50.81,26.04 51.83,26.04 52.08,26.29 52.08,28.83 51.57,29.34 51.06,29.34 50.81,29.08
  pour Top: 77.25,89.38 77.88,89.38 78.12,89.62 79.12,89.62 79.88,90.38 80.5,90.38 81.12,91 81.5,91 81.5,91.75 81.25,92 77.62,92 77.25,91.62
  pour Top: 74.25,91.44 74.25,88.69 73.25,87.69 73.25,84.62 72.81,84.19 71.62,84.19 71,84.81 71,89.31 72.44,90.75 72.44,91.5 72.81,91.88 73.81,91.88
GPIO23(RIGHT.EYE)
  Top 0.152: R2.2 13.22,71 13.22,58.17 17,54.38 17,48.13 21.17,43.97 25.36,43.97 34.53,34.8 34.53,30.35 35.95,28.93 POCKETBEAGLE-1.P2.3
GPIO26
  Top 0.152: CLICK-1.15 67.78,105.71 69.94,103.56 69.94,94.94 71.76,93.12 71.76,91.06 68.94,88.24 68.94,71.4 74.13,66.22 78.32,66.22 80.3,64.24 80.3,26.82 70.7,17.22 70.7,15.47 74.05,12.12 POCKETBEAGLE-1.P1.34
GPIO27(LCD.RESET)
  Top 0.152: X4.6 56.2,50.23 58.51,47.93 58.51,37.34 57.06,35.89 54.16,35.89 52.61,34.34 52.61,30.5 52.89,30.23 55,30.23 56.27,28.96 POCKETBEAGLE-1.P2.19
GPIO44(RIGHT.BTN.LEFT)  (via drill 0.38 pad 0.18)
  Top 0.152: v76.64,46.66 76.64,46.28 65.03,34.67 61.73,34.67 61.35,34.29 POCKETBEAGLE-1.P2.24 | RL.1 86.66,54.65 v87.51,55.5 86.66,56.35 RL.2
  Bottom 0.152: v76.64,46.66 76.64,47.4 84.74,55.5 v87.51,55.5
GPIO45  (via drill 0.38)
  Top 0.152: POCKETBEAGLE-1.P2.33 74.05,28.96 72.78,30.23 72.78,40.59 78.16,45.97 78.16,63.17 77.25,64.08 73.06,64.08 66.81,70.33 66.81,81 63.31,84.51 49.59,84.51 49.13,84.96 v49.13,86.03 | CLICK-1.2 41.98,103.93 v43.57,102.34
  Bottom 0.152: v49.13,86.03 49.13,86.72 49.74,87.33 49.74,90.75 44.79,95.71 44.79,101.12 v43.57,102.34
GPIO46(RIGHT.BTN.TOP)  (via drill 0.38 pad 0.18)
  Top 0.152: v76.03,47.27 76.03,46.13 64.88,34.98 59.5,34.98 58.81,34.29 POCKETBEAGLE-1.P2.22 | RU.1 94.53,62.52 v95.39,63.37 94.53,64.23 RU.2
  Bottom 0.152: v76.03,47.27 92.13,63.37 v95.39,63.37
GPIO47(RIGHT.BTN.BOTTOM)  (via drill 0.38 pad 0.18)
  Top 0.152: v75.42,47.88 74.81,47.27 74.81,45.82 64.58,35.59 54.31,35.59 53.73,35 POCKETBEAGLE-1.P2.18 | RD.1 94.53,46.77 v95.39,47.62 94.53,48.48 RD.2
  Bottom 0.152: v75.42,47.88 74.81,47.27 74.81,46.43 75.5,45.74 77.02,45.74 77.56,46.28 77.56,47.4 84.79,54.63 87.31,54.63 94.32,47.62 v95.39,47.62
GPIO57(LEFT.BTN.TOP)
  Top 0.152: LU.1 LU.2 15.47,56.37 17.31,54.53 17.31,48.28 21.32,44.27 25.51,44.27 34.83,34.95 34.83,30.53 35.14,30.23 37.22,30.23 38.49,31.5 POCKETBEAGLE-1.P2.6
GPIO58(LEFT.BTN.RIGHT)
  Top 0.152: LR.2 LR.1 18.84,47.21 21.47,44.58 25.66,44.58 35.95,34.29 POCKETBEAGLE-1.P2.4
GPIO59(LEFT.BTN.BOTTOM)
  Top 0.152: LD.1 LD.2 25.22,43.65 33.41,35.46 POCKETBEAGLE-1.P2.2
GPIO60(LEFT.BTN.LEFT)
  Top 0.152: LL.1 LL.2 7.59,45.05 10.12,42.52 25.89,42.52 32.29,36.12 32.29,31.01 33.08,30.23 34.15,30.23 34.68,29.69 34.68,26.42 35.19,25.91 39.25,25.91 39.76,26.42 39.76,30.23 41.03,31.5 POCKETBEAGLE-1.P2.8
GPIO64(RIGHT.BTN.RIGHT)  (via drill 0.38 pad 0.18)
  Top 0.152: v75.42,46.66 75.42,45.97 64.73,35.28 57.26,35.28 56.27,34.29 POCKETBEAGLE-1.P2.20 | RR.2 102.41,56.35 v103.26,55.5 102.41,54.65 RR.1
  Bottom 0.152: v75.42,46.66 76.03,46.05 76.87,46.05 77.25,46.43 77.25,47.55 84.64,54.94 102.7,54.94 v103.26,55.5
GPIO65(LCD.RS)
  Top 0.152: X4.7 55.4,50.58 58.2,47.78 58.2,37.49 56.91,36.2 54.01,36.2 52.31,34.49 52.31,30.38 53.73,28.96 POCKETBEAGLE-1.P2.17
GPIO89(LEFT.EYE)
  Top 0.152: R1.2 5.34,65.67 5.34,46.84 9.97,42.22 25.74,42.22 31.99,35.97 31.99,13.26 35.95,9.3 POCKETBEAGLE-1.P1.4
I2C2.SCL  (via drill 0.38 pad 0.18)
  Top 0.152: CLICK-1.12 v68.02,96.65 68.02,95.49 70.77,92.73 70.77,91.44 68.03,88.7 68.03,70.94 73.67,65.3 77.86,65.3 79.38,63.78 79.38,27.28 69.78,17.68 69.78,15.47 66.43,12.12 POCKETBEAGLE-1.P1.28 | U1.6 75.57,101.34 v76.34,102.11 76.85,102.11 R3.1
  Bottom 0.152: v68.02,96.65 73.31,96.65 75.73,99.06 75.73,101.5 v76.34,102.11
I2C2.SDA  (via drill 0.38 pad 0.18)
  Top 0.152: CLICK-1.11 v66.68,95.55 67.5,95.55 70.47,92.58 70.47,91.59 67.72,88.85 67.72,70.79 73.52,65 77.71,65 79.08,63.63 79.08,27.43 69.48,17.83 69.48,15.62 63.89,10.03 POCKETBEAGLE-1.P1.26 | U1.5 76.07,100.83 v76.34,101.09 76.85,101.09 R4.1
  Bottom 0.152: v76.34,101.09 76.03,100.79 76.03,98.91 73.44,96.32 68.49,96.32 67.72,95.55 v66.68,95.55
L
  pour Top: 75.69,88.25 75.69,87.31 76,87 76,84.75 75.12,83.88 75.12,79.88 75.5,79.5 77.5,79.5 77.88,79.88 77.88,87.12 77.75,87.25 76.12,87.25 75.81,87.56 75.81,88.25
LED.K
  Top 0.406: X4.3 58.6,53 59.19,53.59 R9.1 R10.1
N$1
  Top 0.152: LED2.A 19.13,73.62 14.84,73.62 R2.1
N$2
  Top 0.152: LED1.A 7.3,73.62 11.6,73.62 R1.1
N$3  (via drill 0.38 pad 0.18)
  other vias: 30.57,100.36
N$4  (via drill 0.38 pad 0.18)
  other vias: 31.56,100.36
N$5
  Top 0.406: R11.1 74.09,60.74 73.84,60.49 T1.B
N$6  (via drill 0.38 pad 0.18)
  other vias: 31.56,101.07
N$7  (via drill 0.38 pad 0.18)
  other vias: 30.57,101.07
N$8  (via drill 0.38 pad 0.18)
  other vias: 30.69,98.58
N$9  (via drill 0.38 pad 0.18)
  other vias: 31.56,98.58
N$10  (via drill 0.38 pad 0.18)
  other vias: 31.56,97.84
N$11  (via drill 0.38 pad 0.18)
  other vias: 28.99,103.76
N$12  (via drill 0.38 pad 0.18)
  other vias: 28.3,103.76
N$13  (via drill 0.38 pad 0.18)
  other vias: 28.3,102.74
N$14  (via drill 0.38 pad 0.18)
  other vias: 31.56,103.58
N$15  (via drill 0.38 pad 0.18)
  other vias: 31.56,102.84
N$16  (via drill 0.38 pad 0.18)
  other vias: 30.69,102.84
N$17  (via drill 0.46 pad 0.18)
  other vias: 40.36,96.77
N$18  (via drill 0.46 pad 0.18)
  other vias: 40.36,97.69
N$19  (via drill 0.46 pad 0.18)
  other vias: 40.36,98.51
N$20  (via drill 0.46 pad 0.18)
  other vias: 40.36,99.43
N$21  (via drill 0.38 pad 0.18)
  other vias: 28.99,102.74
N$22  (via drill 0.38 pad 0.18)
  other vias: 30.69,97.84
N$23  (via drill 0.38 pad 0.18)
  other vias: 30.69,103.58
N$24  (via drill 0.46 pad 0.18)
  other vias: 39.51,96.77
N$25  (via drill 0.46 pad 0.18)
  other vias: 39.51,97.69
N$26  (via drill 0.46 pad 0.18)
  other vias: 39.51,98.51
N$27  (via drill 0.46 pad 0.18)
  other vias: 39.51,99.43
N$28  (via drill 0.46 pad 0.18)
  other vias: 33.66,96.77
N$29  (via drill 0.46 pad 0.18)
  other vias: 33.66,97.69
N$30  (via drill 0.46 pad 0.18)
  other vias: 33.66,98.51
N$31  (via drill 0.46 pad 0.18)
  other vias: 33.66,99.43
N$32  (via drill 0.46 pad 0.18)
  other vias: 32.81,96.77
N$33  (via drill 0.46 pad 0.18)
  other vias: 32.81,97.69
N$34  (via drill 0.46 pad 0.18)
  other vias: 32.81,98.51
N$35  (via drill 0.46 pad 0.18)
  other vias: 32.81,99.43
N$36
  Top 0.152: T2.C 26.98,62.7 27.57,62.1 27.57,60.2 26.25,58.88 PIEZO1.-
N$37
  Top 0.152: T2.B 30.3,64.45 30.4,64.56 R12.1
N$40  (via drill 0.25)
  Top 0.152: U3.7 v76.25,91.75 | R14.2 81,90.12 v80.5,89.62 81,89.12 R13.1
  Bottom 0.152: v80.5,89.62 78.38,89.62 v76.25,91.75
PRU0.1(BUZZER)  (via drill 0.38 pad 0.18)
  Top 0.152: v36.81,24.99 37.07,24.74 37.07,5.44 37.86,4.65 68.89,4.65 70.24,3.3 70.24,1.02 70.62,0.64 73.92,0.64 74.05,0.76 POCKETBEAGLE-1.P1.33 | R12.2 32.45,65.31 32.45,48.08 37.07,43.46 37.07,34.87 v36.81,34.62
  Bottom 0.152: v36.81,24.99 37.07,25.25 37.07,34.37 v36.81,34.62
PRU0.4(SELECT)  (via drill 0.38 pad 0.18)
  Top 0.152: v37.63,24.99 37.37,24.74 37.37,5.59 38.01,4.95 69.99,4.95 71.51,3.43 POCKETBEAGLE-1.P1.31 | SELECT.1 SELECT.2 35.02,67.58 32.75,65.3 32.75,48.23 37.37,43.61 37.37,34.87 v37.63,34.62
  Bottom 0.152: v37.63,24.99 37.37,25.25 37.37,34.37 v37.63,34.62
PRU1.10(START)
  Top 0.152: START.1 START.2 79.47,65.97 80.91,64.54 80.91,26.52 71.31,16.92 71.31,15.77 79.13,7.95 79.13,5.97 76.59,3.43 POCKETBEAGLE-1.P1.35
PWM0A
  Top 0.152: CLICK-1.16 68.02,105.93 70.24,103.71 70.24,95.1 72.07,93.27 72.07,90.91 69.25,88.09 69.25,71.55 74.28,66.52 78.47,66.52 80.6,64.39 80.6,26.67 71,17.07 71,15.62 76.59,10.03 POCKETBEAGLE-1.P1.36
PWM1A(LCD.BACKLIGHT)
  Top 0.152: R11.2 74.9,62.87 65.97,62.87 59.27,56.16 52.79,56.16 42.15,45.52 42.15,26.14 41.61,25.6 33.84,25.6 33.41,26.04 POCKETBEAGLE-1.P2.1
SPI0.CLK
  Top 0.152: X4.9 53.8,49.78 44.69,40.66 44.69,25.96 45.78,24.87 45.78,14.02 41.03,9.27 POCKETBEAGLE-1.P1.8
SPI0.CS
  Top 0.152: X4.12 51.4,47.84 42.45,38.89 42.45,26.14 43.27,25.32 43.27,14.05 38.49,9.27 POCKETBEAGLE-1.P1.6
SPI0.MOSI
  Top 0.152: X4.8 54.6,50.12 44.99,40.51 44.99,26.11 46.11,24.99 POCKETBEAGLE-1.P1.12
SPI1.CLK  (via drill 0.38)
  Top 0.152: POCKETBEAGLE-1.P2.29 68.97,28.96 67.7,30.23 67.7,36.42 77.56,46.28 77.56,62.87 76.95,63.48 72.75,63.48 66.2,70.03 66.2,80.7 63,83.9 48.98,83.9 47.91,84.96 v47.91,86.03 | CLICK-1.4 43.54,100.63 v43.57,100.66
  Bottom 0.152: v47.91,86.03 47.91,86.41 49.13,87.63 49.13,90.45 44.18,95.4 44.18,100.05 v43.57,100.66
SPI1.CS  (via drill 0.38)
  Top 0.152: POCKETBEAGLE-1.P2.31 71.51,26.16 71.76,25.91 74.81,25.91 75.17,26.26 75.17,34.31 73.09,36.4 73.09,40.44 78.47,45.82 78.47,63.32 77.4,64.39 73.21,64.39 67.12,70.48 67.12,81.15 63.46,84.81 50.35,84.81 v49.74,85.42 | CLICK-1.3 43.58,103.17 v43.57,103.17
  Bottom 0.152: v49.74,85.42 49.74,86.87 50.05,87.17 50.05,90.91 45.09,95.86 45.09,101.64 v43.57,103.17
SPI1.MISO  (via drill 0.38)
  Top 0.152: POCKETBEAGLE-1.P2.27 66.43,26.16 66.68,25.91 69.86,25.91 70.24,26.29 70.24,38.51 77.86,46.13 77.86,63.02 77.1,63.78 72.91,63.78 66.51,70.18 66.51,80.85 63.15,84.2 49.28,84.2 48.52,84.96 v48.52,85.42 | CLICK-1.5 45.16,99.91 v43.57,101.5
  Bottom 0.152: v48.52,85.42 48.52,86.56 49.44,87.48 49.44,90.6 44.48,95.56 44.48,100.58 v43.57,101.5
SPI1.MOSI  (via drill 0.38)
  Top 0.152: POCKETBEAGLE-1.P2.25 63.89,28.96 65.16,30.23 65.16,34.34 77.25,46.43 77.25,62.71 76.79,63.17 72.6,63.17 65.9,69.88 65.9,80.54 62.85,83.59 48.67,83.59 47.3,84.96 v47.3,85.42 | CLICK-1.6 41.98,98.23 v43.57,99.82
  Bottom 0.152: v47.3,85.42 47.3,86.26 48.83,87.78 48.83,90.3 43.88,95.25 43.88,99.52 v43.57,99.82
T1.C
  Top 0.406: R10.2 R9.2 76.72,54.52 76.72,56.64 76.04,57.32 T1.C
UART0.RX
  Top 0.152: CLICK-1.14 68.02,100.9 69.63,99.29 69.63,94.79 71.46,92.96 71.46,91.21 68.64,88.39 68.64,71.25 73.97,65.91 78.16,65.91 79.99,64.08 79.99,26.98 70.39,17.37 70.39,15.32 71.51,14.2 POCKETBEAGLE-1.P1.32
UART0.TX
  Top 0.152: CLICK-1.13 67.83,100.63 69.33,99.14 69.33,94.64 71.08,92.89 71.08,91.29 68.34,88.54 68.34,71.09 73.82,65.61 78.01,65.61 79.69,63.93 79.69,27.13 70.09,17.53 70.09,15.32 68.97,14.2 POCKETBEAGLE-1.P1.30
USB1.D+  (via drill 0.38)
  Top 0.152: U2.3 54.5,95.41 54.85,95.76 54.85,96.54 X2.3 | POCKETBEAGLE-1.P1.11 46.11,3.43 v45.73,3.81
  Bottom 0.152: v45.73,3.81 44.99,3.07 44.99,2.46 45.48,1.98 53.48,1.98 54.85,3.35 54.85,96.54 X2.3
USB1.D-  (via drill 0.38)
  Top 0.152: U2.1 55.5,95.41 55.15,95.76 55.15,96.54 X2.2 | POCKETBEAGLE-1.P1.9 43.57,3.43 v43.95,3.81
  Bottom 0.152: v43.95,3.81 44.69,3.07 44.69,2.31 45.32,1.68 53.63,1.68 55.15,3.2 55.15,96.54 X2.2
USB1.ID  (via drill 0.38, 0.38 pad 0.18)
  Top 0.152: v42.68,14.38 42.96,14.66 42.96,24.74 v42.3,25.4 | v41.54,34.67 R15.2 | POCKETBEAGLE-1.P1.13 v48.65,3.81
  Bottom 0.152: v42.68,14.38 45.35,14.38 49.67,10.06 49.67,4.83 v48.65,3.81 | v42.3,25.4 42.3,33.91 v41.54,34.67
VAUX  (via drill 0.25)
  Top 0.152: U3.1 74.75,87.75 74.56,87.56 v74.19,87.56 | v72.12,89.62 72.25,89.62 C6.1
  Bottom 0.152: v74.19,87.56 v72.12,89.62
VOUT  (via drill 0.25, 0.38 pad 0.18, 0.61 pad 0.18)
  Top 0.152: U3.8 75.75,91.5 v75.5,91.75 76,92.25 76.5,92.25 76.75,92 U3.6
  Bottom 0.152: v75.5,91.75 76,91.25 76.31,91.25 77.88,89.69 77.88,88.38 v77.62,88.12
  Bottom 1.016: v57.52,47.62 58.05,48.16 58.05,51.66 70.62,64.24 v70.62,71.69
  pour Top (rank 2): 60.72,5.71 61.98,5.71 62.49,6.22 62.49,8.76 61.73,9.53 61.73,19.68 59.7,21.72 50.3,21.72 49.03,22.99 49.03,25.15 50.3,26.42 50.3,39.88 57.82,47.4 57.82,47.7 57.59,47.93 57.29,47.93 49.54,40.18 49.54,30.99 47.25,28.7 47.25,26.16 48.27,25.15 48.27,22.61 49.92,20.95 59.45,20.95 60.97,19.43 60.97,9.53 60.21,8.76 60.21,6.22
  pour Top: 76.62,88.25 77.12,88.25 77.75,88.88 80.38,88.88 81,88.25 82.75,88.25 82.75,79.5 81.5,78.25 74,78.25 71.06,75.31 71.06,71.5 70.81,71.25 70.44,71.25 70.19,71.5 70.19,75.62 73.56,79 77.75,79 78.62,79.88 78.62,87.25 78.25,87.62 76.75,87.62 76.62,87.75
WP
  Top 0.152: JMP1.1 75.07,106.43 75.07,101.61 R8.1 75.07,101.59 U1.7

### Text on the board
tPlace: EEPROM / WP | - | + | PocketBeagle | Gamepup | A4